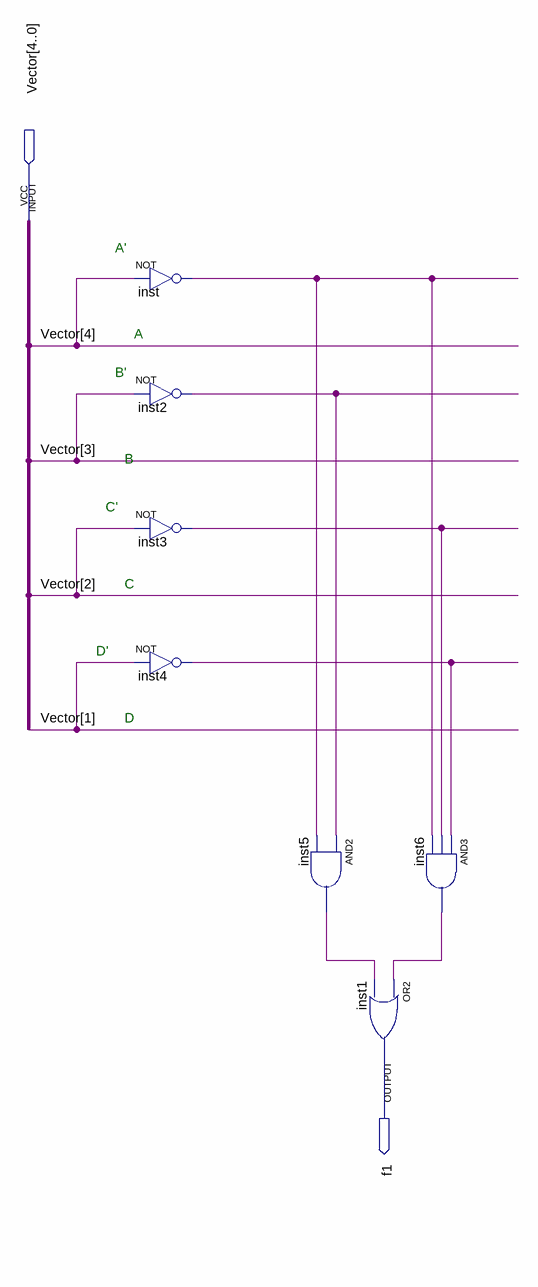
[diagram p0: schematic sheet]
// Quartus schematic f1.bdf as structural Verilog: 7 symbols, 2 pins
module f1 (
  input  [4:0] Vector,
  output f1
);

  wire inst2_out, inst3_out, inst4_out, inst5_out, inst6_out, inst_out;

  not inst (inst_out, Vector[4]);
  not inst2 (inst2_out, Vector[3]);
  not inst3 (inst3_out, Vector[2]);
  not inst4 (inst4_out, Vector[1]);
  and inst5 (inst5_out, inst2_out, inst_out);
  or inst1 (f1, inst6_out, inst5_out);
  and inst6 (inst6_out, inst4_out, inst3_out, inst_out);

  // Notes on the sheet:
  //   A'
  //   A
  //   B'
  //   B
  //   C'
  //   C
  //   D'
  //   D
endmodule
